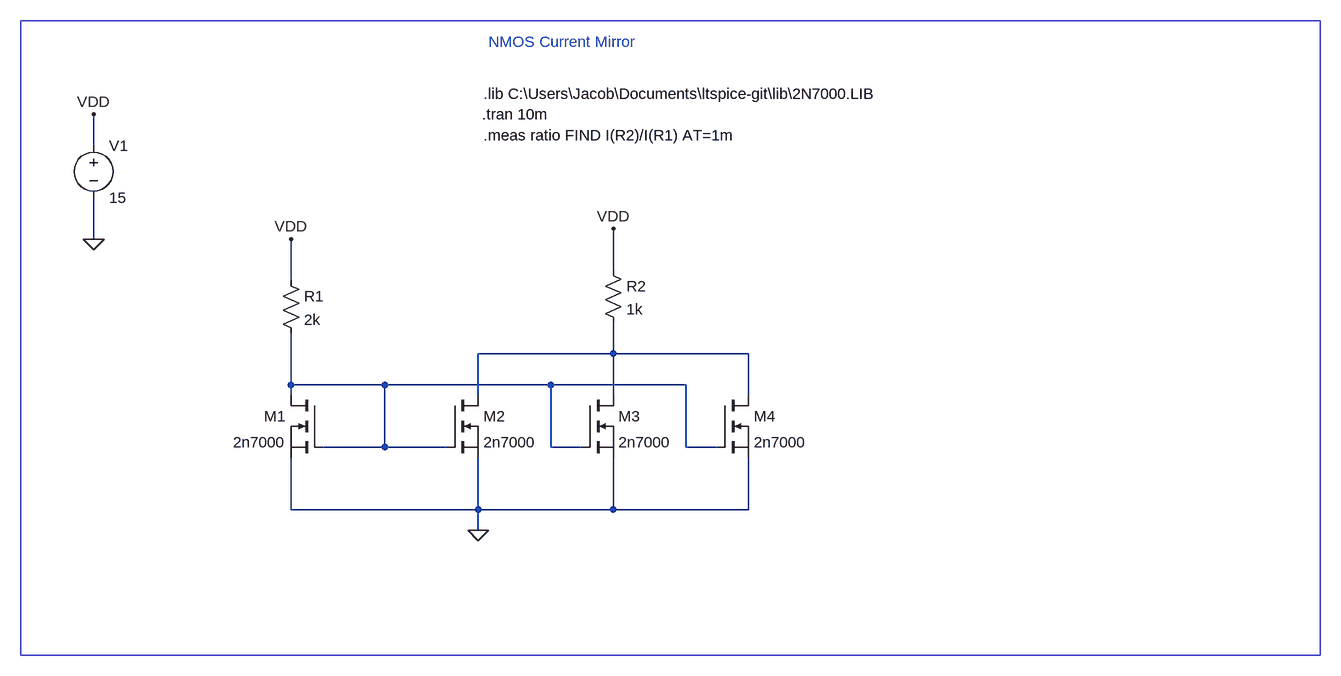
[diagram p0: schematic nmos_current_mirror.asc]
nmos_current_mirror.asc, the LTspice schematic file:
Version 4
SHEET 1 1588 680
WIRE -368 -416 -368 -464
WIRE -368 -272 -368 -336
WIRE 432 -224 432 -288
WIRE -64 -208 -64 -272
WIRE 432 -96 432 -144
WIRE 432 -96 224 -96
WIRE 640 -96 432 -96
WIRE -64 -48 -64 -128
WIRE 80 -48 -64 -48
WIRE 336 -48 80 -48
WIRE 544 -48 336 -48
WIRE -64 -32 -64 -48
WIRE 224 -32 224 -96
WIRE 432 -32 432 -96
WIRE 640 -32 640 -96
WIRE 80 48 80 -48
WIRE 80 48 -16 48
WIRE 176 48 80 48
WIRE 336 48 336 -48
WIRE 384 48 336 48
WIRE 544 48 544 -48
WIRE 592 48 544 48
WIRE -64 144 -64 64
WIRE 224 144 224 64
WIRE 224 144 -64 144
WIRE 432 144 432 64
WIRE 432 144 224 144
WIRE 640 144 640 64
WIRE 640 144 432 144
WIRE 224 176 224 144
FLAG -368 -464 VDD
FLAG -368 -272 0
FLAG -64 -272 VDD
FLAG 224 176 0
FLAG 432 -288 VDD
SYMBOL nmos -16 -32 M0
SYMATTR InstName M1
SYMATTR Value 2n7000
SYMATTR Prefix X
SYMBOL nmos 176 -32 R0
SYMATTR InstName M2
SYMATTR Value 2n7000
SYMATTR Prefix X
SYMBOL res -80 -224 R0
SYMATTR InstName R1
SYMATTR Value 2k
SYMBOL voltage -368 -432 R0
WINDOW 123 0 0 Left 0
WINDOW 39 0 0 Left 0
SYMATTR InstName V1
SYMATTR Value 15
SYMBOL res 416 -240 R0
SYMATTR InstName R2
SYMATTR Value 1k
SYMBOL nmos 384 -32 R0
SYMATTR InstName M3
SYMATTR Value 2n7000
SYMATTR Prefix X
SYMBOL nmos 592 -32 R0
SYMATTR InstName M4
SYMATTR Value 2n7000
SYMATTR Prefix X
TEXT 232 -496 Left 2 !.lib C:\\Users\\Jacob\\Documents\\ltspice-git\\lib\\2N7000.LIB
TEXT 230 -464 Left 2 !.tran 10m
TEXT 240 -576 Left 2 ;NMOS Current Mirror
TEXT 232 -432 Left 2 !.meas ratio FIND I(R2)/I(R1) AT=1m
RECTANGLE Normal 1520 368 -480 -608

The netlist it stands for:
* nmos_current_mirror.asc
XM1 N002 N002 0 2n7000  ; pins D G S
XM2 N001 N002 0 2n7000  ; pins D G S
R1 VDD N002 2k
V1 VDD 0 15
R2 VDD N001 1k
XM3 N001 N002 0 2n7000  ; pins D G S
XM4 N001 N002 0 2n7000  ; pins D G S
.lib C:\Users\Jacob\Documents\ltspice-git\lib\2N7000.LIB
.tran 10m
* NMOS Current Mirror
.meas ratio FIND I(R2)/I(R1) AT=1m
.backanno
.end